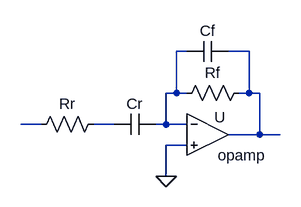
[diagram p0: schematic diffAmp.asc]
diffAmp.asc, the LTspice schematic file:
Version 4
SHEET 1 880 680
WIRE 176 16 160 16
WIRE 272 16 240 16
WIRE 160 80 160 16
WIRE 160 80 144 80
WIRE 176 80 160 80
WIRE 272 80 272 16
WIRE 272 80 256 80
WIRE 288 80 272 80
WIRE -48 128 -80 128
WIRE 64 128 32 128
WIRE 144 128 144 80
WIRE 144 128 128 128
WIRE 176 128 144 128
WIRE 288 144 288 80
WIRE 288 144 240 144
WIRE 320 144 288 144
WIRE 176 160 144 160
WIRE 144 208 144 160
FLAG 144 208 0
SYMBOL Opamps\\opamp 208 80 R0
WINDOW 0 10 37 Left 2
SYMATTR InstName U
SYMBOL res 48 112 R90
WINDOW 0 0 56 VBottom 2
WINDOW 3 -52 239 VTop 2
SYMATTR InstName Rr
SYMATTR Value ""
SYMBOL res 272 64 R90
WINDOW 0 0 56 VBottom 2
WINDOW 3 -26 21 VTop 2
SYMATTR InstName Rf
SYMATTR Value ""
SYMBOL cap 128 112 R90
WINDOW 0 0 32 VBottom 2
WINDOW 3 32 32 VTop 2
SYMATTR InstName Cr
SYMATTR Value ""
SYMBOL cap 240 0 R90
WINDOW 0 0 32 VBottom 2
WINDOW 3 32 32 VTop 2
SYMATTR InstName Cf
SYMATTR Value ""

The netlist it stands for:
* diffAmp.asc
XU N001 0 N002 opamp Aol=100K GBW=10Meg  ; pins invin noninvin out
Rr N004 N003
Rf N002 N001
Cr N001 N004
Cf N002 N001
.backanno
.end